# Altium schematic sheet Audio Filters.SchDoc
size A4
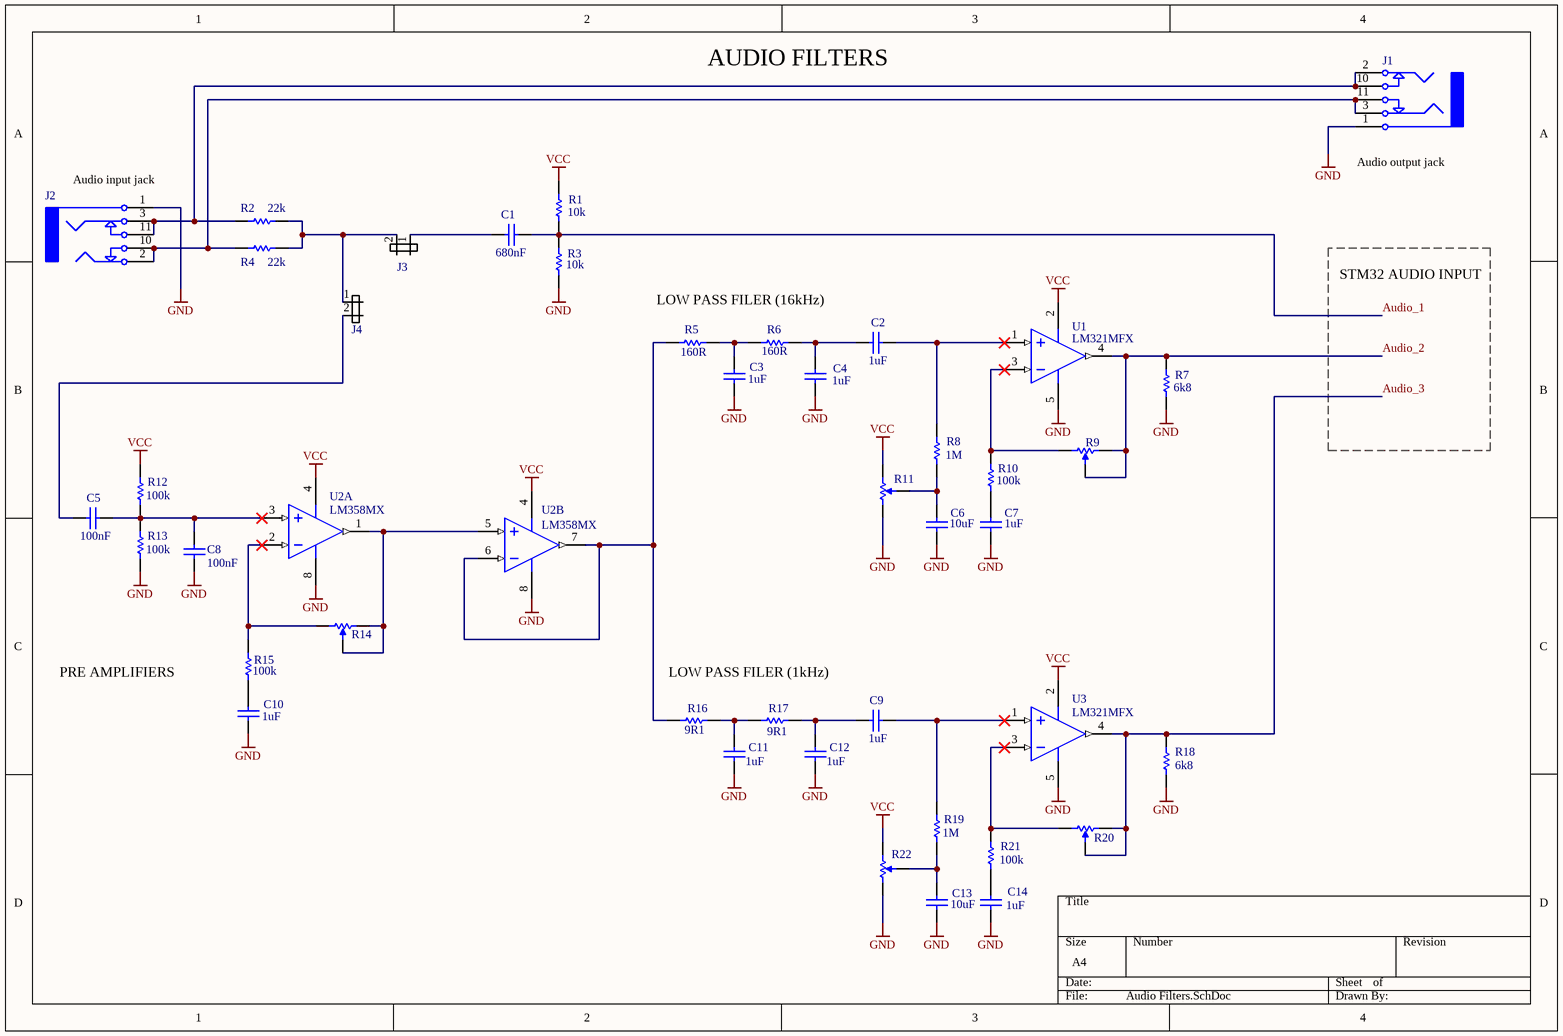
[diagram p0: Audio Filters.SchDoc]

## Parts
C1  value 680nF  [CAPC0603(1608)100_N]  (hidden comment: CAP 680nF 25V 0603(1608))
C2  value 1uF  [CAPC0603(1608)100_N]  (hidden comment: CAP 1uF 16V 0603(1608))
C3  value 1uF  [CAPC0603(1608)100_N]  (hidden comment: CAP 1uF 16V 0603(1608))
C4  value 1uF  [CAPC0603(1608)100_N]  (hidden comment: CAP 1uF 16V 0603(1608))
C5  value 100nF  [CAPC0603(1608)100_N]  (hidden comment: CAP 100nF 25V 0603(1608))
C6  value 10uF  [CAPC0603(1608)100_M]  (hidden comment: CAP 10uF 6.3V 0603(1608))
C7  value 1uF  [CAPC0603(1608)100_N]  (hidden comment: CAP 1uF 16V 0603(1608))
C8  value 100nF  [CAPC0603(1608)100_N]  (hidden comment: CAP 100nF 25V 0603(1608))
C9  value 1uF  [CAPC0603(1608)100_N]  (hidden comment: CAP 1uF 16V 0603(1608))
C10  value 1uF  [CAPC0603(1608)100_N]  (hidden comment: CAP 1uF 16V 0603(1608))
C11  value 1uF  [CAPC0603(1608)100_N]  (hidden comment: CAP 1uF 16V 0603(1608))
C12  value 1uF  [CAPC0603(1608)100_N]  (hidden comment: CAP 1uF 16V 0603(1608))
C13  value 10uF  [CAPC0603(1608)100_M]  (hidden comment: CAP 10uF 6.3V 0603(1608))
C14  value 1uF  [CAPC0603(1608)100_N]  (hidden comment: CAP 1uF 16V 0603(1608))
J1  TSH-3675-BE-PA66-G  [TECHNIC-TSH-3675-BLUE_V]  (value not drawn)
J2  TSH-3675-BE-PA66-G  [TECHNIC-TSH-3675-BLUE_V]  (value not drawn)
J3  (no value)  [J_THT_HDR_1x2_R2.54-V]
J4  (no value)  [J_THT_HDR_1x2_R2.54-V]
R1  value 10k  [RESC0603(1608)_N]  (hidden comment: 10K 1% 0603(1608))
R2  value 22k  [RESC0603(1608)_L]  (hidden comment: 22K 1% 0603(1608))
R3  value 10k  [RESC0603(1608)_N]  (hidden comment: 10K 1% 0603(1608))
R4  value 22k  [RESC0603(1608)_L]  (hidden comment: 22K 1% 0603(1608))
R5  value 160R  [RESC0603(1608)_M]  (hidden comment: 160R 1% 0603(1608))
R6  value 160R  [RESC0603(1608)_M]  (hidden comment: 160R 1% 0603(1608))
R7  value 6k8  [RESC0603(1608)_L]  (hidden comment: 6K81 1% 0603(1608))
R8  value 1M  [RESC0603(1608)_L]  (hidden comment: 1M 1% 0603(1608))
R9  35WR10KLFTR  [BI-35WR10KLFTR-3_V]  (value not drawn)
R10  value 100k  [RESC0603(1608)_N]  (hidden comment: 100K 5% 0603(1608))
R11  35WR10KLFTR  [BI-35WR10KLFTR-3_V]  (value not drawn)
R12  value 100k  [RESC0603(1608)_N]  (hidden comment: 100K 5% 0603(1608))
R13  value 100k  [RESC0603(1608)_N]  (hidden comment: 100K 5% 0603(1608))
R14  35WR10KLFTR  [BI-35WR10KLFTR-3_V]  (value not drawn)
R15  value 100k  [RESC0603(1608)_N]  (hidden comment: 100K 5% 0603(1608))
R16  value 9R1  [RESC0603(1608)_M]  (hidden comment: 9R1 1% 0603(1608))
R17  value 9R1  [RESC0603(1608)_M]  (hidden comment: 9R1 1% 0603(1608))
R18  value 6k8  [RESC0603(1608)_L]  (hidden comment: 6K81 1% 0603(1608))
R19  value 1M  [RESC0603(1608)_L]  (hidden comment: 1M 1% 0603(1608))
R20  35WR10KLFTR  [BI-35WR10KLFTR-3_V]  (value not drawn)
R21  value 100k  [RESC0603(1608)_N]  (hidden comment: 100K 5% 0603(1608))
R22  35WR10KLFTR  [BI-35WR10KLFTR-3_V]  (value not drawn)
U1  LM321MFX  [DBV0005A_L]
U2  LM358MX  [D0008A_M]  (parts A,B of 2)
U3  LM321MFX  [DBV0005A_L]

## Nets
GND: C3.1 C4.1 C6.1 C7.1 C8.2 C10.1 C11.1 C12.1 C13.1 C14.1 J1.1 J2.1 R3.1 R7.1 R11.1 R13.1 R18.1 R22.1 U1.5(V+) U2.8(V+) U3.5(V+)
VCC: R1.2 R11.3 R12.2 R22.3 U1.2(V-) U2.4(GND) U3.2(V-)
Audio_1: C1.2 R1.1 R3.2
Audio_2: R7.2 R9.2 R9.3 U1.4(OUT)
Audio_3: R18.2 R20.2 R20.3 U3.4(OUT)
NetC1_1: C1.1 J3.1
NetC2_1: C2.1 R8.2 U1.1(IN+)
NetC2_2: C2.2 C4.2 R6.2
NetC3_2: C3.2 R5.2 R6.1
NetC5_1: C5.1 C8.1 R12.1 R13.2 U2.3(INA+)
NetC5_2: C5.2 J4.2
NetC6_2: C6.2 R8.1 R11.2
NetC7_2: C7.2 R10.1
NetC9_1: C9.1 R19.2 U3.1(IN+)
NetC9_2: C9.2 C12.2 R17.2
NetC10_2: C10.2 R15.1
NetC11_2: C11.2 R16.2 R17.1
NetC13_2: C13.2 R19.1 R22.2
NetC14_2: C14.2 R21.1
NetJ1_2: J1.2 J1.10 J2.3 J2.11 R2.1
NetJ1_3: J1.3 J1.11 J2.2 J2.10 R4.1
NetJ3_2: J3.2 J4.1 R2.2 R4.2
NetR5_1: R5.1 R16.1 U2.6(INB-) U2.7(OUTB)
NetR9_1: R9.1 R10.2 U1.3(IN-)
NetR14_1: R14.1 R15.2 U2.2(INA-)
NetR14_2: R14.2 R14.3 U2.1(OUTA) U2.5(INB+)
NetR20_1: R20.1 R21.2 U3.3(IN-)

## Notes on the sheet
- AUDIO FILTERS
- (near J1) Audio output jack
- (near J2) Audio input jack
- LOW PASS FILER (16kHz)
- STM32 AUDIO INPUT
- PRE AMPLIFIERS
- LOW PASS FILER (1kHz)

## Library data of the parts
C1 = CMP-1035-02722-1: CAP 680nF 25V ±10% 0603 (1608 Metric) Thickness 1mm SMD; Case-Metric: 1608; Tolerance: Â±10%; Case-EIA: 0603; Max Thickness: 1 mm; Technology: SMT; Rated Voltage: 25 V
C2-C4 C7 C9-C12 C14 = CMP-1035-02736-1: CAP 1uF 16V ±5% 0603 (1608 Metric) Thickness 1mm SMD; Case-Metric: 1608; Case-EIA: 0603; Tolerance: Â±5%; Technology: SMT; Max Thickness: 1 mm; Rated Voltage: 16 V
C5 C8 = CMP-1035-02589-1: CAP 100nF 25V ±20% 0603 (1608 Metric) Thickness 1mm SMD; Case-EIA: 0603; Tolerance: Â±20%; Case-Metric: 1608; Max Thickness: 1 mm; Technology: SMT; Rated Voltage: 25 V
C6 C13 = CMP-1035-02796-1: CAP 10uF 6.3V ±10% 0603 (1608 Metric) Thickness 1mm SMD; Case-EIA: 0603; Tolerance: Â±10%; Case-Metric: 1608; Technology: SMT; Rated Voltage: 6.3 V; Max Thickness: 1 mm
J1 J2 = CMP-0437-00002-1: Connector, 3.5mm Stereo Audio Socket, Blue; Manufacturer: Technik Industrial; Mounting Technology: Through Hole; DatasheetVersion: Feb-10; ComponentLink1URL: http://www.technik.com.hk/; ComponentLink2Description: Datasheet; PartNumber: TSH-3675-BE-PA66-G; PackageDescription: 3.5mm Stereo Audio Socket, Blue; PackageReference: TSH-3675; ComponentLink1Description: Manufacturer URL; ComponentLink2URL: http://www.technik.com.hk/images/pdf_product/SH367-PA66-C.pdf
J3 J4 = J_HDR_1x2_JUMPER: Złącze gold pin 1x2 na jumper
R1 R3 = CMP-1012-00623-1: 10K 0.1W 1% 0603 (1608 Metric)  SMD; Case-EIA: 0603; Case-Metric: 1608; Power: 0.1 W; Tolerance: 1 %; Technology: SMT
R2 R4 = CMP-1012-00659-1: 22K 0.1W 1% 0603 (1608 Metric)  SMD; Case-EIA: 0603; Case-Metric: 1608; Technology: SMT; Power: 0.1 W; Tolerance: 1 %
R5 R6 = CMP-1012-00418-1: 160R 0.1W 1% 0603 (1608 Metric)  SMD; Case-Metric: 1608; Case-EIA: 0603; Tolerance: 1 %; Technology: SMT; Power: 0.1 W
R7 R18 = CMP-1012-00605-1: 6K81 0.1W 1% 0603 (1608 Metric)  SMD; Case-EIA: 0603; Case-Metric: 1608; Tolerance: 1 %; Power: 0.1 W; Technology: SMT
R8 R19 = CMP-1012-00849-1: 1M 0.1W 1% 0603 (1608 Metric)  SMD; Case-EIA: 0603; Case-Metric: 1608; Power: 0.1 W; Tolerance: 1 %; Technology: SMT
R9 R11 R14 R20 R22 = CMP-1745-00001-1: 3 mm Single-Turn Open Frame Surface Mount Cermet Trimming Potentiometer, +/- 25%, 35 W, -40 to 125 degC, 3-Pin SMD, RoHS, Tape and Reel; Frequency: 16 MHz; Load Capacitance: 20 pF; Frequency Tolerance: 30ppm; ESR: 40 Ohm; Tolerance: 50ppm; Capacitance: 2E-11 f; Packaging: Tape and Reel; Min Operating Temperature: -20degC; Height: 0.177 inch; ComponentLink1URL: http://www.bi-technologies.net/; Radiation Hardening: No; Mount: Surface Mount; ComponentLink2Description: Datasheet; Pins: 2; Max Operating Temperature: 70degC; DatasheetVersion: Feb-10; PackageDescription: 3-Pin Surface Mount Device, Body 3 x 3.1 mm; Package Quantity: 1; RoHSCompliant: True; ComponentLink1Description: Manufacturer URL; PackageReference: 35WR10KLFTR; ComponentLink2URL: http://www.bitechnologies.com/pdfs/35.pdf; REACH SVHC: No SVHC; Resistance: 40 Ohm; Width: 0.197 inch; Length: 0.461 inch
R10 R12 R13 R15 R21 = CMP-1012-00122-1: 100K 0.1W 5% 0603 (1608 Metric)  SMD; Case-EIA: 0603; Case-Metric: 1608; Tolerance: 5 %; Power: 0.1 W; Technology: SMT
R16 R17 = CMP-1012-00280-1: 9R1 0.1W 1% 0603 (1608 Metric)  SMD; Case-Metric: 1608; Case-EIA: 0603; Technology: SMT; Tolerance: 1 %; Power: 0.1 W
U1 U3 = CMP-0055-01337-3: Low Power Single Op Amp, 5-pin SOT-23; Manufacturer: Texas Instruments; PowerWise: N; CompType: Amplifiers; PackageTopMarking: A63A*XTT; ComponentLink1Description: Datasheet URL; PackageDescription: Molded SOT-23, .115 x .063 x .040 in Body, 5 Lead, .0375 in Pitch; PinCount: 5; ComponentLink1URL: http://www.ti.com/general/docs/lit/getliterature.tsp?genericPartNumber=LM321&fileType=pdf; RoHS: N; Package Reference: DBV0005A
U2 = CMP-0055-00630-3: Low Power Dual Operational Amplifier, 8-pin Narrow SOIC; Manufacturer: Texas Instruments; PowerWise: N; PackageTopMarking: NSZXTT*LM*358M; CompType: Amplifiers; ComponentLink1URL: http://www.ti.com/general/docs/lit/getliterature.tsp?genericPartNumber=LM358-N&fileType=pdf; PinCount: 8; PackageDescription: SOIC Narrow, 4.9 x 3.9 x 1.45mm, 8 Lead, 1.27mm Pitch; Code_IPC: SOIC127P600-8; RoHS: N; Code_JEDEC: MS-012-AA; Package Reference: D0008A; ComponentLink1Description: Datasheet URL; PartId: 1